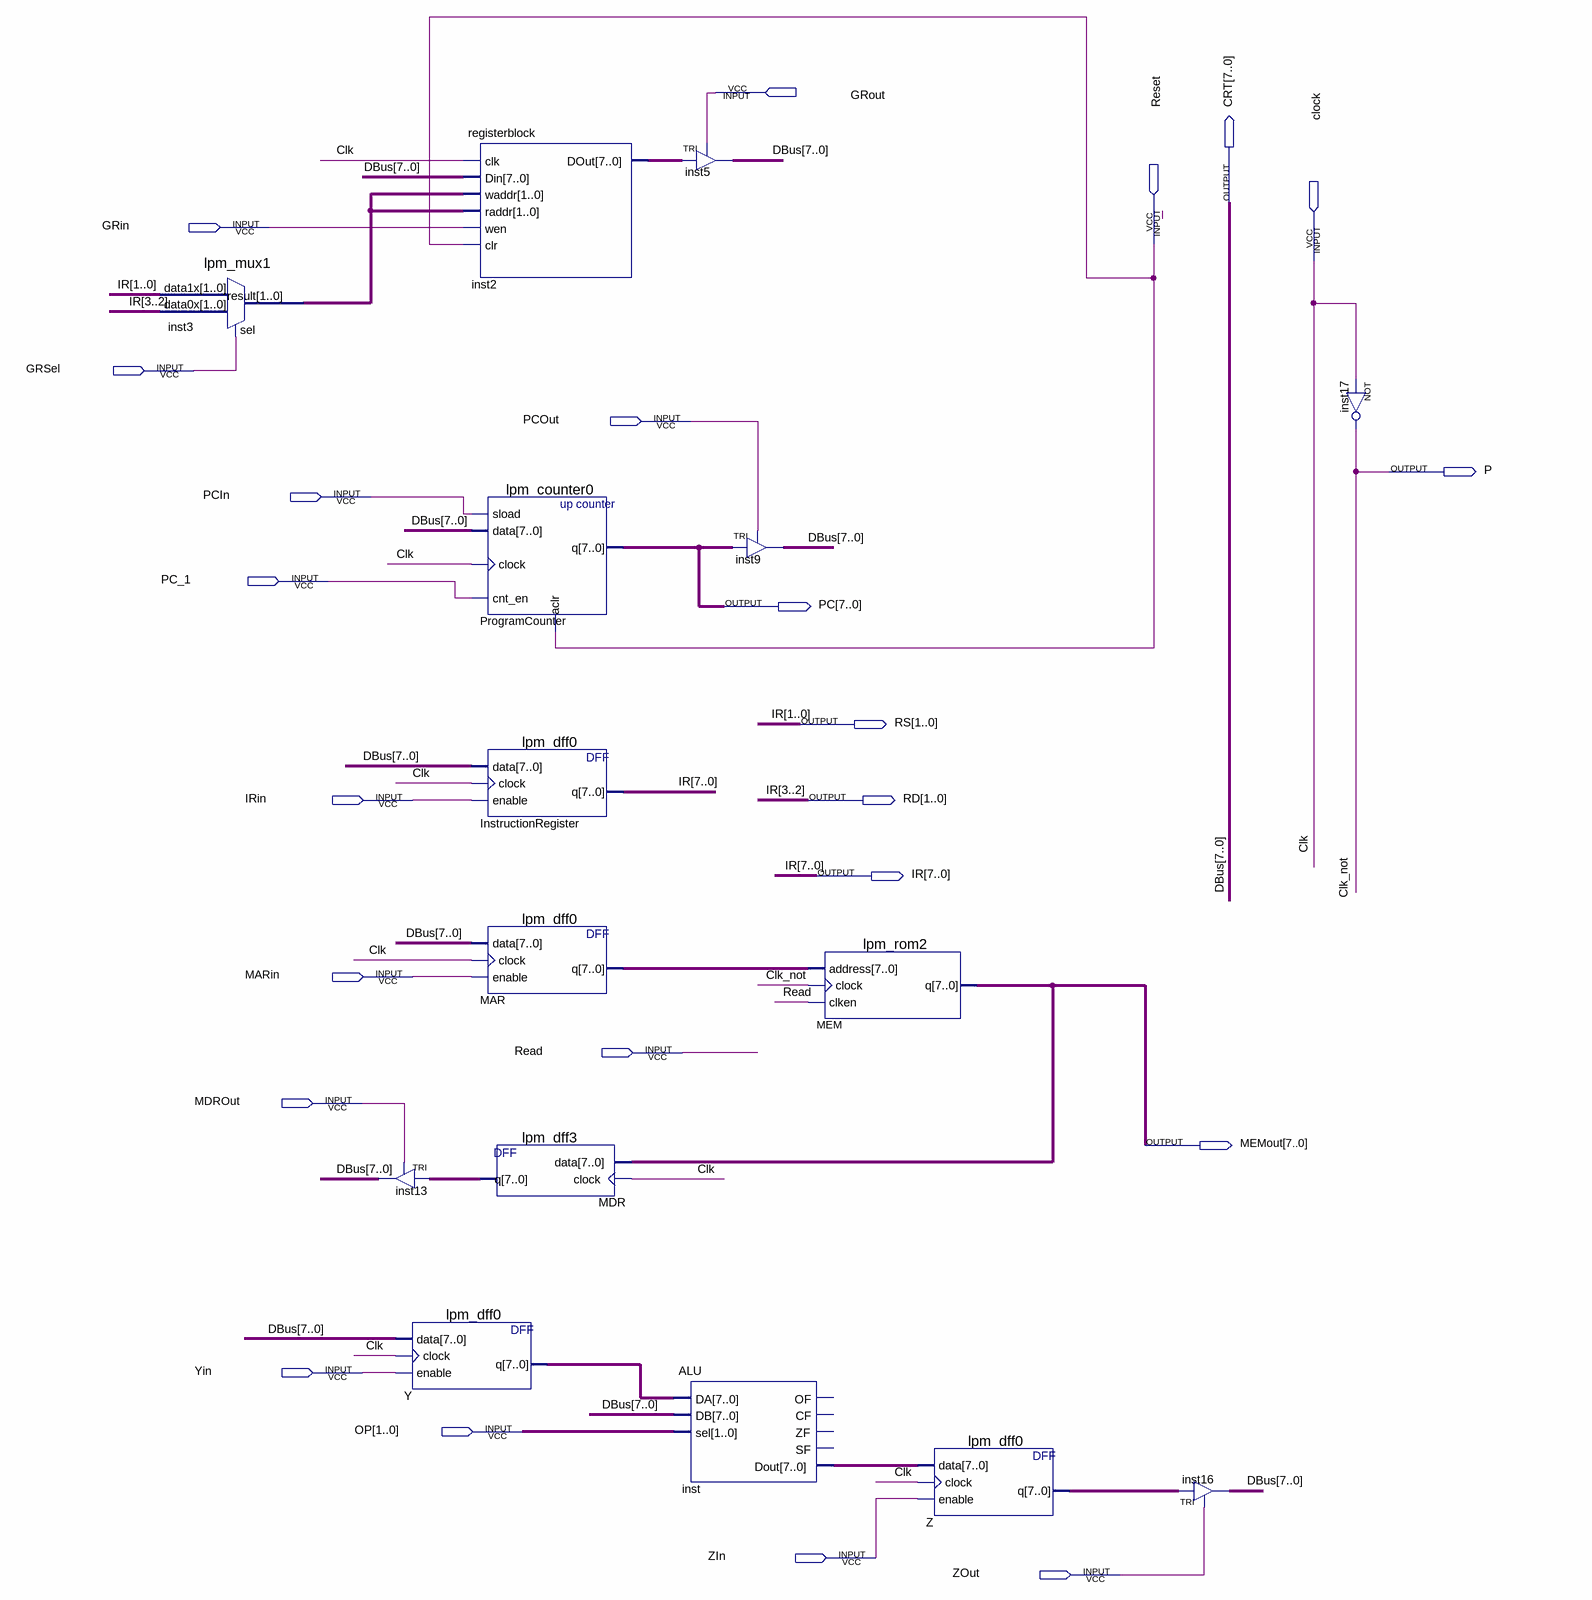
[diagram p0: schematic sheet]
// Quartus schematic CPU.bdf as structural Verilog: 15 symbols, 23 pins
module CPU (
  input  GRout,
  input  GRin,
  input  Reset,
  input  clock,
  input  GRSel,
  input  PCOut,
  input  PCIn,
  input  PC_1,
  input  IRin,
  input  MARin,
  input  Read,
  input  MDROut,
  input  Yin,
  input  [1:0] OP,
  input  ZIn,
  input  ZOut,
  output [7:0] CRT,
  output P,
  output [7:0] PC,
  output [1:0] RS,
  output [1:0] RD,
  output [7:0] IR,
  output [7:0] MEMout
);

  wire [1:0] inst3_result;
  wire [7:0] inst2_dout, inst_dout, MAR_q, MDR_q, Y_q, Z_q;

  lpm_mux1 inst3 (.data1x(IR[1:0]), .data0x(IR[3:2]), .sel(GRSel), .result(inst3_result));
  TRI inst13[7:0] (.IN(MDR_q), .OE(MDROut), .OUT(CRT));
  lpm_dff0 Y (.data(CRT), .clock(clock), .enable(Yin), .q(Y_q));
  registerblock inst2 (
    .clk(clock), .Din(CRT), .waddr(inst3_result), .raddr(inst3_result), .wen(GRin), .clr(Reset),
    .DOut(inst2_dout));
  lpm_counter0 ProgramCounter (.sload(PCIn), .data(CRT), .clock(clock), .cnt_en(PC_1), .aclr(Reset), .q(PC));
  lpm_dff0 InstructionRegister (.data(CRT), .clock(clock), .enable(IRin), .q(IR));
  lpm_dff0 MAR (.data(CRT), .clock(clock), .enable(MARin), .q(MAR_q));
  lpm_dff3 MDR (.data(MEMout), .clock(clock), .q(MDR_q));
  ALU inst (.DA(Y_q), .DB(CRT), .sel(OP), .Dout(inst_dout));  // open: OF, CF, ZF, SF
  TRI inst5[7:0] (.IN(inst2_dout), .OE(GRout), .OUT(CRT));
  TRI inst9[7:0] (.IN(PC), .OE(PCOut), .OUT(CRT));
  lpm_rom2 MEM (.address(MAR_q), .clock(P), .clken(Read), .q(MEMout));
  lpm_dff0 Z (.data(inst_dout), .clock(clock), .enable(ZIn), .q(Z_q));
  TRI inst16[7:0] (.IN(Z_q), .OE(ZOut), .OUT(CRT));
  not inst17 (P, clock);

  assign RD = IR[3:2];
  assign RS = IR[1:0];

  // Other names for the same wires on the sheet: Clk = clock; DBus[7:0] = CRT; Clk_not = P
endmodule
